# EasyEDA Pro project ProPrj_单片机_2024-09-22.epro

# Schematic Schematic1
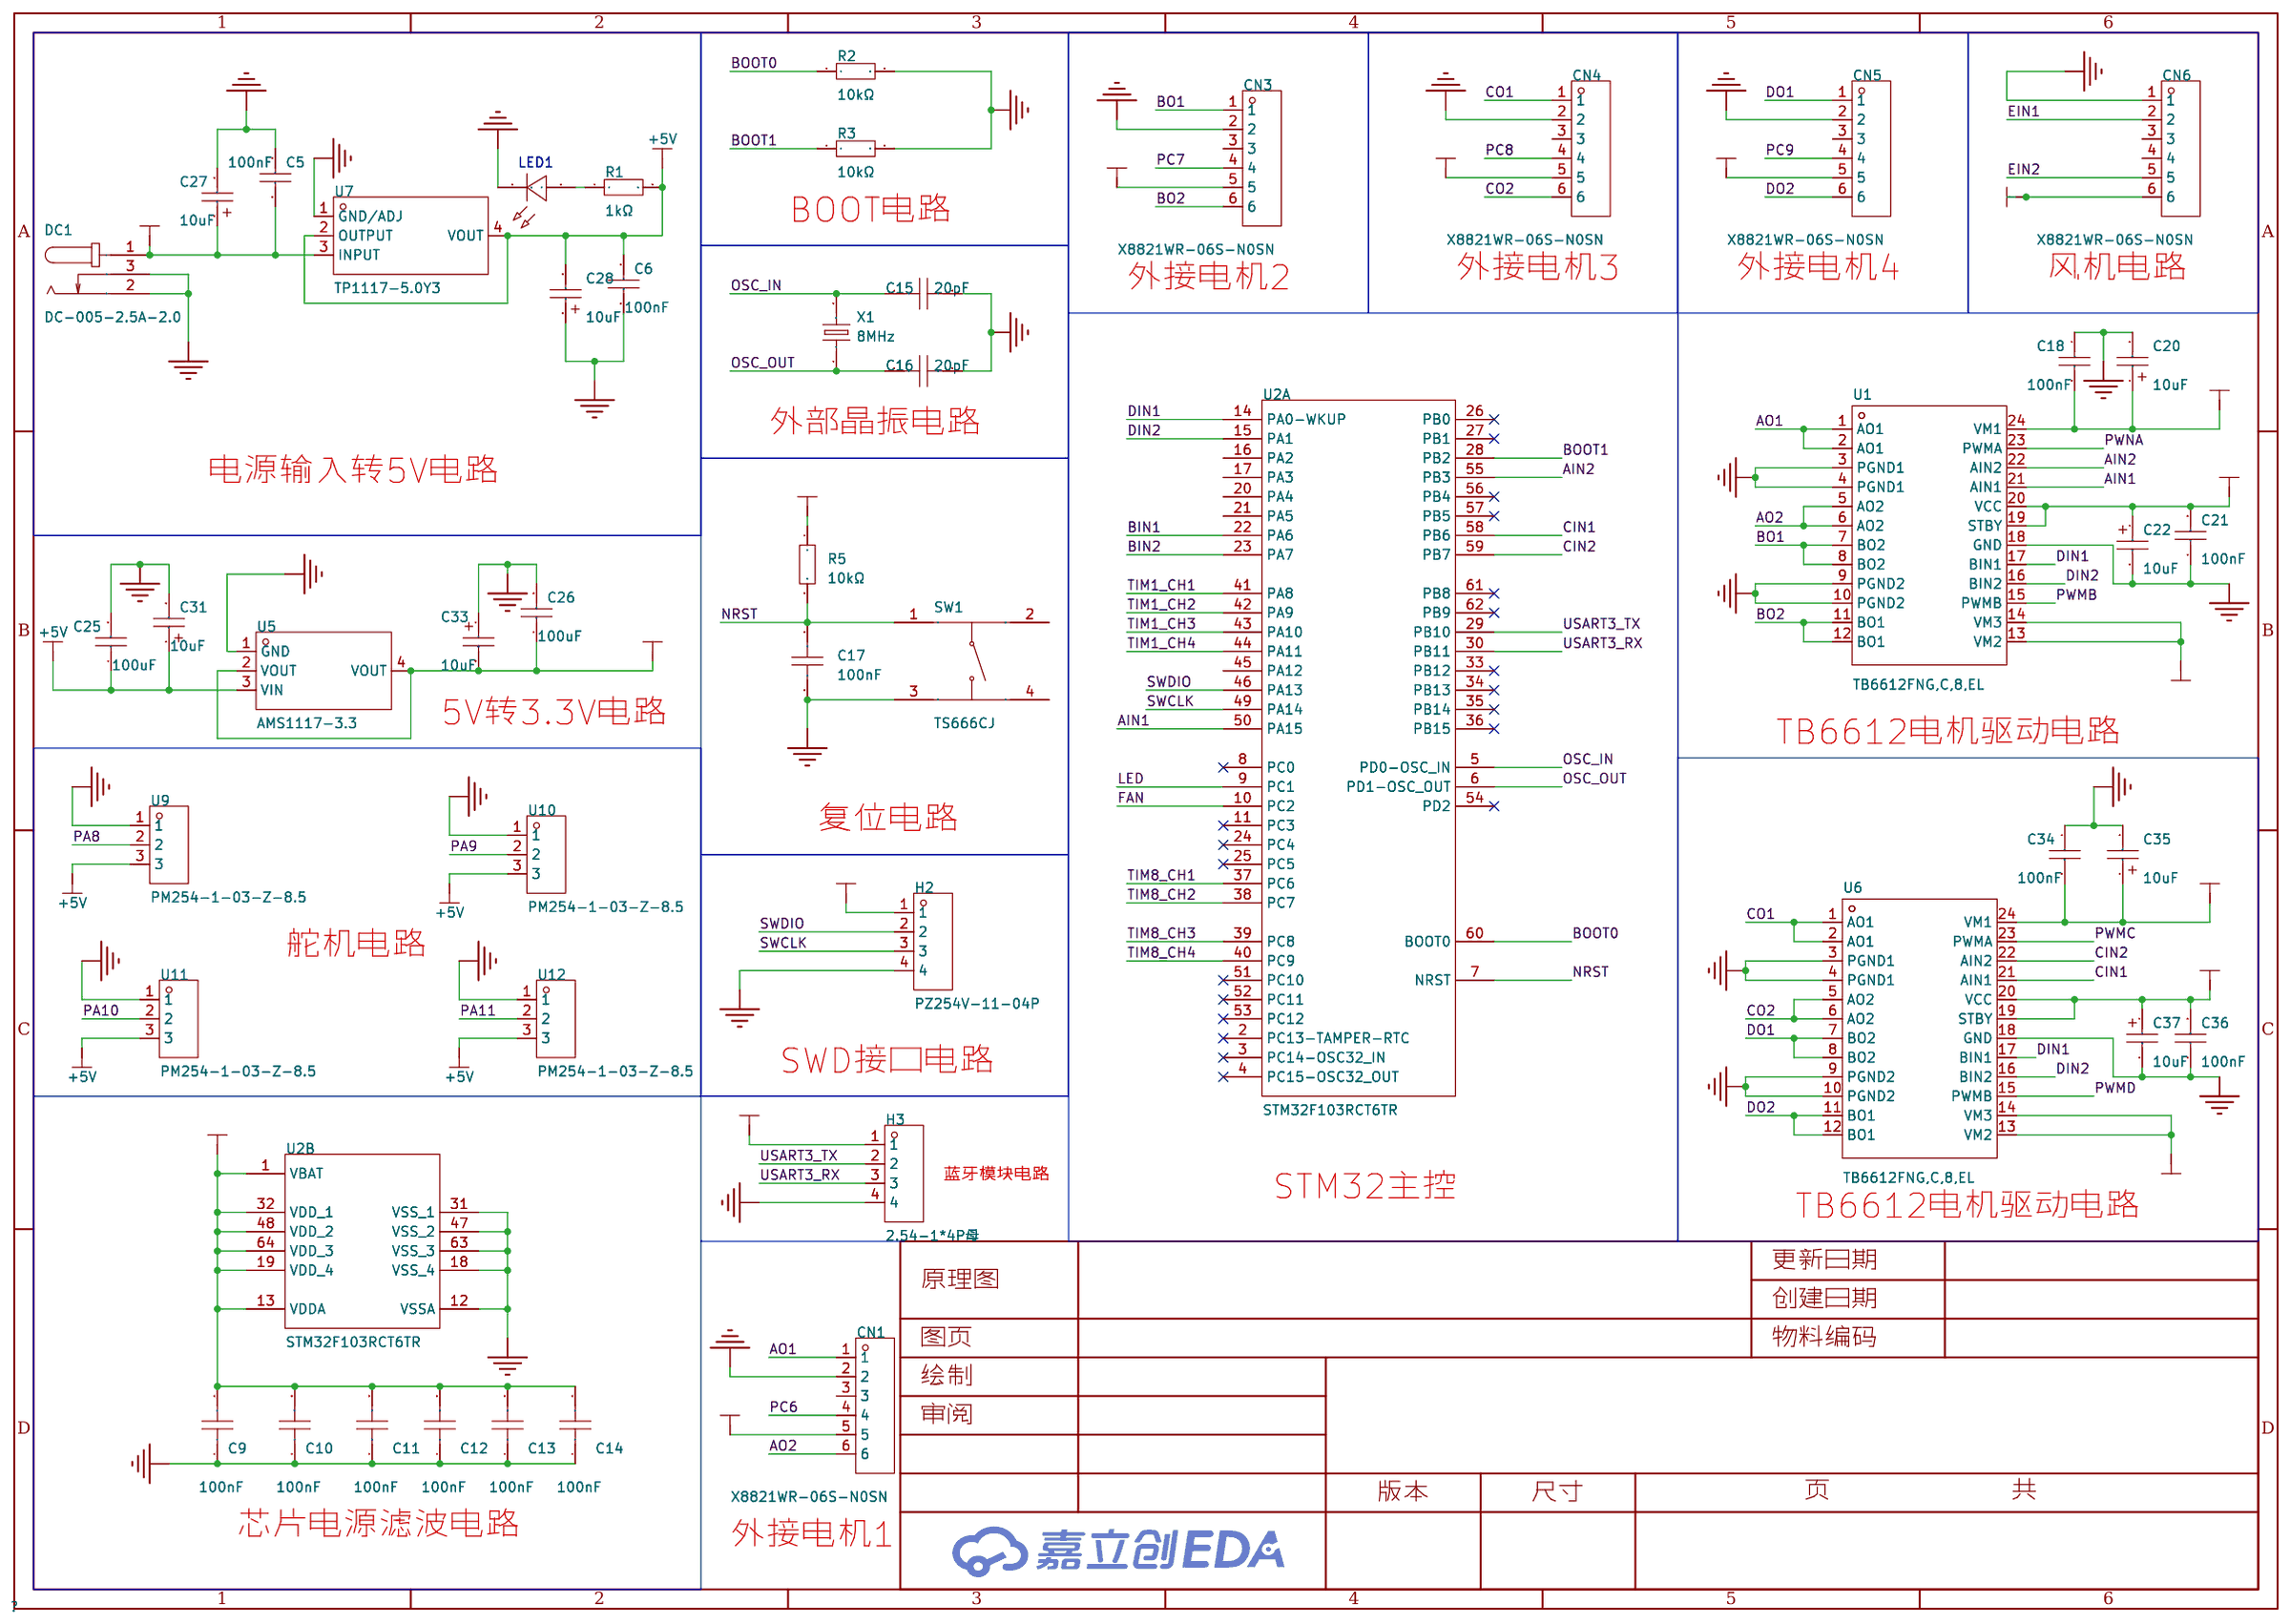
[diagram p0: schematic sheet]

## Parts
C5  100nF  [C0805]
C6  100nF  [C0805]
C9  100nF  [C0603]
C10  100nF  [C0603]
C11  100nF  [C0603]
C12  100nF  [C0603]
C13  100nF  [C0603]
C14  100nF  [C0603]
C15  20pF  [C0805]
C16  20pF  [C0805]
C17  100nF  [C0603]
C18  100nF  [C0805]
C20  10uF  [CAP-SMD_L3.2-W1.6-RD-C7171]
C21  100nF  [C0805]
C22  10uF  [CAP-SMD_L3.2-W1.6-RD-C7171]
C25  100uF  [C0805]
C26  100uF  [C0805]
C27  10uF  [CAP-SMD_L3.2-W1.6-RD-C7171]
C28  10uF  [CAP-SMD_L3.2-W1.6-RD-C7171]
C31  10uF  [CAP-SMD_L3.2-W1.6-RD-C7171]
C33  10uF  [CAP-SMD_L3.2-W1.6-RD-C7171]
C34  100nF  [C0805]
C35  10uF  [CAP-SMD_L3.2-W1.6-RD-C7171]
C36  100nF  [C0805]
C37  10uF  [CAP-SMD_L3.2-W1.6-RD-C7171]
CN1  X8821WR-06S-N0SN  [CONN-TH_6P-P2.50_X8821WR-06S-N2SN]
CN3  X8821WR-06S-N0SN  [CONN-TH_6P-P2.50_X8821WR-06S-N2SN]
CN4  X8821WR-06S-N0SN  [CONN-TH_6P-P2.50_X8821WR-06S-N2SN]
CN5  X8821WR-06S-N0SN  [CONN-TH_6P-P2.50_X8821WR-06S-N2SN]
CN6  X8821WR-06S-N0SN  [CONN-TH_6P-P2.50_X8821WR-06S-N2SN]
DC1  DC-005-2.5A-2.0  [CONN-TH_DC-005-2.5A-2.0]
H2  PZ254V-11-04P  [HDR-TH_4P-P2.54-V-M]
H3  2.54-1*4P母  [HDR-TH_4P-P2.54-V-F]
LED1  -  [LED_0805]
R1  1kΩ  [R0805]
R2  10kΩ  [R0603]
R3  10kΩ  [R0603]
R5  10kΩ  [R0603]
SW1  TS666CJ  [SW-TH_4P-L6.0-W6.0-P4.50-LS6.5]
U1  TB6612FNG,C,8,EL  [SSOP-24_L8.3-W5.6-P0.65-LS7.6-BL]
U2  STM32F103RCT6TR  [LQFP-64_L10.0-W10.0-P0.50-LS12.0-BL]  (sections 1,2)
U5  AMS1117-3.3  [SOT-223-3_L6.5-W3.4-P2.30-LS7.0-BR]
U6  TB6612FNG,C,8,EL  [SSOP-24_L8.3-W5.6-P0.65-LS7.6-BL]
U7  TP1117-5.0Y3  [SOT-223-3_L6.5-W3.4-P2.30-LS7.0-BR]
U9  PM254-1-03-Z-8.5  [HDR-TH_3P-P2.54-V-F]
U10  PM254-1-03-Z-8.5  [HDR-TH_3P-P2.54-V-F]
U11  PM254-1-03-Z-8.5  [HDR-TH_3P-P2.54-V-F]
U12  PM254-1-03-Z-8.5  [HDR-TH_3P-P2.54-V-F]
X1  8MHz  [HC-49US_L11.5-W4.5-P4.88]

## Library data of the parts
C5 C6 C18 C21 C34 C36 = CC0805KRX7R9BB104: 容值:100nF;精度:±10%;额定电压:50V;材质(温度系数):X7R;; LCSC Part Name: 100nF ±10% 50V; Supplier Part: C49678; Manufacturer: YAGEO(国巨); Supplier Footprint: 0805; JLCPCB Part Class: 基础库; Datasheet: https://atta.szlcsc.com/upload/public/pdf/source/20180224/C181747_15194369449651363981.pdf; Supplier: LCSC; Tolerance: ±10%; Voltage Rated: 50V; Temperature Coefficient: X7R
C9-C14 C17 = CC0603KRX7R9BB104: 容值:100nF;精度:±10%;额定电压:50V;材质(温度系数):X7R;; LCSC Part Name: 100nF ±10% 50V; Supplier Part: C14663; Manufacturer: YAGEO(国巨); Supplier Footprint: 0603; JLCPCB Part Class: 基础库; Datasheet: https://atta.szlcsc.com/upload/public/pdf/source/20180910/C282072_33301C7F631E79921B82A8DAC6BCC5B3.pdf; Supplier: LCSC; Tolerance: ±10%; Voltage Rated: 50V; Temperature Coefficient: X7R
C15 C16 = 0805CG200J500NT: 容值:20pF;精度:±5%;额定电压:50V;材质(温度系数):C0G;; LCSC Part Name: 20pF ±5% 50V; Supplier Part: C94472; Manufacturer: FH(风华); Supplier Footprint: 0805; JLCPCB Part Class: 扩展库; Datasheet: https://atta.szlcsc.com/upload/public/pdf/source/20200305/C486355_26A10D38EF8C2A5C37091D0039909270.pdf; Supplier: LCSC; Tolerance: ±5%; Voltage Rated: 50V; Temperature Coefficient: C0G
C20 C22 C27 C28 C31 C33 C35 C37 = TAJA106K016RNJ: 容值:10uF;精度:±10%;额定电压:16V;等效串联电阻:3Ω@100kHz;; LCSC Part Name: 10uF ±10% 16V; Supplier Part: C7171; Manufacturer: Kyocera AVX; Supplier Footprint: CASE-A-3216; JLCPCB Part Class: 基础库; Datasheet: https://atta.szlcsc.com/upload/public/pdf/source/20160107/1457707750344.pdf; Supplier: LCSC; Tolerance: ±10%; Rated Voltage: 16V; Equivalent Series Resistance(ESR): 3Ω@100kHz; Operating Temperature: -55℃~+125℃
C25 C26 = GRM21BR60J107ME15L: 容值:100uF;精度:±20%;额定电压:6.3V;材质(温度系数):X5R;; LCSC Part Name: 100uF ±20% 6.3V; Supplier Part: C141660; Manufacturer: muRata(村田); Supplier Footprint: 0805; JLCPCB Part Class: Extended Part; Datasheet: https://atta.szlcsc.com/upload/public/pdf/source/20171113/C141660_15105613320671115822.pdf; Supplier: LCSC; Tolerance: ±20%; Voltage Rated: 6.3V; Temperature Coefficient: X5R
CN1 CN3-CN6 = X8821WR-06S-N0SN: 插针结构:1x6P;间距:2.5mm;安装方式:弯插;参考系列:XH;总PIN数:6P;排数:1;每排PIN数:6;行距:-;额定电流:3A;触头材质:黄铜;触头镀层:锡;工作温度范围:-;; LCSC Part Name: 1x6P 间距:2.5mm 弯插 系列:XH; Supplier Part: C388743; Manufacturer: XKB Connection(中国星坤); Supplier Footprint: 弯插,P=2.54mm; JLCPCB Part Class: 扩展库; Datasheet: https://atta.szlcsc.com/upload/public/pdf/source/20211009/984C14C41D2B1156BCF8EEF5D296E395.pdf; Supplier: LCSC; Pins Structure: 1x6P; Pitch: 2.5mm; Mounting Style: 弯插; Reference Series: XH; Number of Pins: 6P; Number of Rows: 1; Number of PINs Per Row: 6; Current Rating (Max): 3A; Contact Material: 黄铜; Contact Plating: 锡
DC1 = DC-005-2.5A-2.0: 连接器类型:DC电源插座;安装方式:面板安装;触点内径:2mm;触点外径:6.2mm;额定电流:2.5A;额定电压:24V;触头材质:黄铜;工作温度范围:-20℃~+70℃;焊接温度(最大值):260℃;; LCSC Part Name: DC电源插座 内径:2mm 外径:6.2mm; Supplier Part: C319099; Manufacturer: XKB Connection(中国星坤); Supplier Footprint: 插件; JLCPCB Part Class: 扩展库; Datasheet: https://atta.szlcsc.com/upload/public/pdf/source/20230410/3C172F25A51FCA230ABE6D36425CBB3B.pdf; Supplier: LCSC; Connector Type: DC电源插座; Mounting Style: 面板安装; Inside Contact Diameter: 2mm; Outside Contact Diameter: 6.2mm; Current Rating (Max): 2.5A; Voltage Rating (Max): 24V; Contact Material: 黄铜; Operating Temperature Range: -20℃~+70℃; Soldering Temperature(Max): 260℃
H2 = PZ254V-11-04P: 插针结构:1x4P;间距:2.54mm;行距:-;圆针/方针:方针;安装类型:直插;排数:单排;总PIN位数:4P;额定电流:3A;额定电压:250V;配合针长度:6mm;塑高:2.5mm;端接针长度:3mm;触头材质:-;工作温度范围:-40℃~+105℃;颜色:黑色;; LCSC Part Name: 间距:2.54mm 1x4P 直插 方针; Supplier Part: C2691448; Manufacturer: XFCN(兴飞); Supplier Footprint: 插件,P=2.54mm; JLCPCB Part Class: 扩展库; Datasheet: https://atta.szlcsc.com/upload/public/pdf/source/20200309/C492403_F9F19131791D08044AD4F84F8E751A34.pdf; Supplier: LCSC; Pin Structure: 1x4P; Pitch: 2.54mm; Circluar Pins/Square Pins: 方针; Mounting Type: 直插; Number of Rows: 单排; Number of Pins: 4P; Current Rating (Max): 3A; Voltage Rating (Max): 250V; Length of Mating Pin: 6mm; Insulation Height: 2.5mm; Length of End Connection Pin: 3mm; Operating Temperature Range: -40℃~+105℃; Color: 黑色
H3 = 2.54-1*4P母: 插孔结构:1x4P;间距:2.54mm;行距:-;圆孔/方孔:方孔;安装类型:直插;排数:单排;总孔位数:4P;额定电流:3A;额定电压:-;插孔方向:顶部;塑高:-;触头材质:青铜;触头镀层:-;工作温度范围:-40℃~+105℃;焊接温度(最大值):-;; LCSC Part Name: 间距:2.54mm 1x4P 直插; Supplier Part: C2718488; Manufacturer: BOOMELE(博穆精密); Supplier Footprint: 插件,P=2.54mm; JLCPCB Part Class: 扩展库; Datasheet: https://atta.szlcsc.com/upload/public/pdf/source/20210301/C2718488_F4427B881E42CAA8DDB0B1C12B3A522C.pdf; Supplier: LCSC; Holes Structure: 1x4P; Pitch: 2.54mm; Circular Hole / Square Hole: 方孔; Mounting Type: 直插; Number of Rows: 单排; Number of Holes: 4P; Current Rating (Max): 3A; Holes Direction: 顶部; Contact Material: 青铜; Operating Temperature Range: -40℃~+105℃
LED1 = LED_0805-B: Supplier Footprint: 0805
R1 = 0805W8F1001T5E: 电阻类型:厚膜电阻;阻值:1kΩ;精度:±1%;功率:125mW;最大工作电压:150V;温度系数:±100ppm/℃;; LCSC Part Name: 1kΩ ±1% 125mW 厚膜电阻; Supplier Part: C17513; Manufacturer: UNI-ROYAL(厚声); Supplier Footprint: 0805; JLCPCB Part Class: 基础库; Datasheet: https://atta.szlcsc.com/upload/public/pdf/source/20200306/C422600_1E6D84923E4A46A82E41ADD87F860B5C.pdf; Supplier: LCSC; Type: 厚膜电阻; Tolerance: ±1%; Power(Watts): 125mW; Overload Voltage (Max): 150V; Temperature Coefficient: ±100ppm/℃; Operating Temperature Range: -55℃~+155℃
R2 R3 R5 = 0603WAF1002T5E: 电阻类型:厚膜电阻;阻值:10kΩ;精度:±1%;功率:100mW;最大工作电压:75V;温度系数:±100ppm/℃;; LCSC Part Name: 厚膜电阻 10kΩ ±1% 100mW; Supplier Part: C25804; Manufacturer: UNI-ROYAL(厚声); Supplier Footprint: 0603; JLCPCB Part Class: 基础库; Datasheet: https://atta.szlcsc.com/upload/public/pdf/source/20200306/C422600_1E6D84923E4A46A82E41ADD87F860B5C.pdf; Supplier: LCSC; Type: 厚膜电阻; Tolerance: ±1%; Power(Watts): 100mW; Overload Voltage (Max): 75V; Temperature Coefficient: ±100ppm/℃; Operating Temperature Range: -55℃~+155℃
SW1 = TS666CJ: 电路结构:单刀单掷;按钮形状:圆形按钮;作用力:250gf;安装方式:直插;开关长度:6mm;开关宽度:6mm;开关高度:6mm;带支架:不带;触点电流:50mA;额定电压(DC):12V;绝缘电阻:100MΩ;机械寿命:5万次;; LCSC Part Name: 6*6*6mm 直插 轻触开关; Supplier Part: C557621; Manufacturer: SHOU HAN(首韩); Supplier Footprint: 插件; JLCPCB Part Class: 扩展库; Datasheet: https://atta.szlcsc.com/upload/public/pdf/source/20200519/C557621_524FC94A9E7193E97F84899CC7F1F8B2.pdf; Supplier: LCSC; Circuit: 单刀单掷; Actuator Style: 圆形按钮; Operating Force: 250gf; Mounting Style: 直插; Switch Length: 6mm; Switch Width: 6mm; Switch Height: 6mm; Strike Gundam: 不带; Contact Current: 50mA; Voltage Rating (DC): 12V; Insulation Resistance: 100MΩ; Actuator/Cap Color: 黑色; Pin Style: PC引脚; Mechanical Life: 5万次; Operating Temperature: -20℃~+85℃
U1 U6 = TB6612FNG,C,8,EL: LCSC Part Name: 1A 有刷直流电机驱动芯片 5.5V; Supplier Part: C141517; Manufacturer: TOSHIBA(东芝); Supplier Footprint: SSOP-24; JLCPCB Part Class: 扩展库; Datasheet: https://atta.szlcsc.com/upload/public/pdf/source/20171128/C141517_15118625624231147036.pdf; Supplier: LCSC
U2 = STM32F103RCT6TR: CPU内核:ARM-M3;程序存储容量:256KB;RAM总容量:48KB;GPIO端口数量:51;工作电压范围:2V~3.6V;CPU最大主频:72MHz;程序存储器类型:FLASH;; LCSC Part Name: 主流增强型ARM Cortex-M3 MCU，具有256 KB Flash、72 MHz CPU、电机控制、USB和CAN; Supplier Part: C39704; Manufacturer: ST(意法半导体); Supplier Footprint: LQFP-64(10x10); JLCPCB Part Class: 扩展库; Datasheet: https://atta.szlcsc.com/upload/public/pdf/source/20151012/1457707442737.pdf; Supplier: LCSC; CPU Core: ARM-M3; Program Storage Size: 256KB; RAM Size: 48KB; GPIO Ports Number: 51; Operating Voltage Range: 2V~3.6V; CPU Maximum Speed: 72MHz; Program Memory Type: FLASH; Operating Temperature Range: -40℃~+85℃; ADC (Bit): 12bit; DAC (Bit): 12bit; Universal Serial Bus: 有; Peripheral/Function: 看门狗；DMA；看门狗；温度传感器; Watchdog: 有; Infrared Data Association: 有; Low-Voltage Detect: 有; Direct Memory Access: 有; Internal Oscillator: 有
U5 = AMS1117-3.3_C6186: 输出类型:固定;最大输入电压:-;输出电压:3.3V;最大输出电流:1A;电源纹波抑制比(PSRR):72dB@(120Hz);输出极性:正极;; LCSC Part Name: 输出3.3V 1A; Supplier Part: C6186; Manufacturer: AMS; Supplier Footprint: SOT-223; JLCPCB Part Class: 基础库; Datasheet: https://atta.szlcsc.com/upload/public/pdf/source/20180727/C6186_7A095716F0823C02F1997A905E26C086.pdf; Supplier: LCSC; Output Type: 固定; Output Voltage: 3.3V; MAX Output Current: 1A; Power Supply Rejection Ratio (PSRR): 72dB@(120Hz); Dropout Voltage: 1.3V@(800mA); Output Polarity: 正极; Number of Outputs: 1
U7 = TP1117-5.0Y3: Supplier Part: C18212700; Manufacturer: TECH PUBLIC(台舟); Supplier Footprint: SOT-223; JLCPCB Part Class: 扩展库; Datasheet: https://atta.szlcsc.com/upload/public/pdf/source/20231020/15FA3214E61D91131000BDD217625D22.pdf; Supplier: LCSC
U9-U12 = PM254-1-03-Z-8.5: 插孔结构:1x3P;间距:2.54mm;行距:-;圆孔/方孔:方孔;安装类型:直插;排数:单排;总孔位数:3P;额定电流:3A;额定电压:-;插孔方向:顶部;塑高:8.5mm;触头材质:铜合金;工作温度范围:-40℃~+105℃;焊接温度(最大值):260℃@5S;; LCSC Part Name: 1x3P 间距:2.54mm 直插; Supplier Part: C2897366; Manufacturer: HCTL(华灿天禄); Supplier Footprint: 插件,P=2.54mm; JLCPCB Part Class: 扩展库; Datasheet: https://atta.szlcsc.com/upload/public/pdf/source/20230609/534BE42964C679BDE98E061007C4ABD6.pdf; Supplier: LCSC; Holes Structure: 1x3P; Pitch: 2.54mm; Circular Hole / Square Hole: 方孔; Mounting Type: 直插; Number of Rows: 单排; Number of Holes: 3P; Current Rating (Max): 3A; Holes Direction: 顶部; Insulation Height: 8.5mm; Contact Material: 铜合金; Operating Temperature Range: -40℃~+105℃; Soldering Temperature(Max): 260℃@5S
X1 = 49S-8.000-20-20-20/A: 晶振类型:直插晶振;频率:8MHz;常温频差:±20ppm;外接负载电容:20pF;频率稳定度(全温):±20ppm;; LCSC Part Name: 8MHz ±20ppm 20pF; Supplier Part: C240916; Manufacturer: LIMING(利明); Supplier Footprint: HC-49S; JLCPCB Part Class: 扩展库; Datasheet: https://atta.szlcsc.com/upload/public/pdf/source/20180930/C240954_D21D826943E58A9880472B1227802F84.pdf; Supplier: LCSC; Crystal Type: 直插晶振; Normal temperature Frequency Tolerance: ±20ppm; External load capacitor: 20pF; Frequency Stability(Full temperature range): ±20ppm; Operating Temperature: -20℃~+70℃

## Nets
8V: C5.2 C27.1 DC1.1 U7.3(INPUT)
+3.3V: C9.2 C10.2 C11.2 C12.2 C13.2 C14.2 C21.2 C22.1 C26.1 C33.2 C36.2 C37.1 CN1.5 CN3.5 CN4.5 CN5.5 H2.1 H3.1 R5.1 U1.19(STBY) U1.20(VCC) U2.1(VBAT) U2.13(VDDA) U2.19(VDD_4) U2.32(VDD_1) U2.48(VDD_2) U2.64(VDD_3) U5.2(VOUT) U5.4(VOUT) U6.19(STBY) U6.20(VCC)
+5V: C6.1 C25.1 C28.2 C31.1 R1.2 U5.3(VIN) U7.2(OUTPUT) U7.4(VOUT) U9.3 U10.3 U11.3 U12.3
+8V: C18.2 C20.1 C34.2 C35.1 U1.13(VM2) U1.14(VM3) U1.24(VM1) U6.13(VM2) U6.14(VM3) U6.24(VM1)
+12V: CN6.6
GND: C5.1 C6.2 C9.1 C10.1 C11.1 C12.1 C13.1 C14.1 C15.2 C16.2 C17.1 C18.1 C20.2 C21.1 C22.2 C25.2 C26.2 C27.2 C28.1 C31.2 C33.1 C34.1 C35.2 C36.1 C37.2 CN1.2 CN3.2 CN4.2 CN5.2 CN6.1 DC1.2 DC1.3 H2.4 H3.4 LED1.1(C) R2.2 R3.2 SW1.3(C) U1.3(PGND1) U1.4(PGND1) U1.9(PGND2) U1.10(PGND2) U1.18(GND) U2.12(VSSA) U2.18(VSS_4) U2.31(VSS_1) U2.47(VSS_2) U2.63(VSS_3) U5.1(GND) U6.3(PGND1) U6.4(PGND1) U6.9(PGND2) U6.10(PGND2) U6.18(GND) U7.1(GND/ADJ) U9.1 U10.1 U11.1 U12.1
AIN1: U1.21(AIN1) U2.50(PA15)
AIN2: U1.22(AIN2) U2.55(PB3)
AO1: CN1.1 U1.1(AO1) U1.2(AO1)
AO2: CN1.6 U1.5(AO2) U1.6(AO2)
BIN1: U2.22(PA6)
BIN2: U2.23(PA7)
BO1: CN3.1 U1.7(BO2) U1.8(BO2)
BO2: CN3.6 U1.11(BO1) U1.12(BO1)
BOOT0: R2.1 U2.60(BOOT0)
BOOT1: R3.1 U2.28(PB2)
CIN1: U2.58(PB6) U6.21(AIN1)
CIN2: U2.59(PB7) U6.22(AIN2)
CO1: CN4.1 U6.1(AO1) U6.2(AO1)
CO2: CN4.6 U6.5(AO2) U6.6(AO2)
DIN1: U1.17(BIN1) U2.14(PA0-WKUP) U6.17(BIN1)
DIN2: U1.16(BIN2) U2.15(PA1) U6.16(BIN2)
DO1: CN5.1 U6.7(BO2) U6.8(BO2)
DO2: CN5.6 U6.11(BO1) U6.12(BO1)
EIN1: CN6.2
EIN2: CN6.5
FAN: U2.10(PC2)
LED: U2.9(PC1)
NRST: C17.2 R5.2 SW1.1(A) U2.7(NRST)
OSC_IN: C15.1 U2.5(PD0-OSC_IN) X1.2
OSC_OUT: C16.1 U2.6(PD1-OSC_OUT) X1.1
PA8: U9.2
PA9: U10.2
PA10: U11.2
PA11: U12.2
PC6: CN1.4
PC7: CN3.4
PC8: CN4.4
PC9: CN5.4
PWMB: U1.15(PWMB)
PWMC: U6.23(PWMA)
PWMD: U6.15(PWMB)
PWNA: U1.23(PWMA)
SWCLK: H2.3 U2.49(PA14)
SWDIO: H2.2 U2.46(PA13)
TIM1_CH1: U2.41(PA8)
TIM1_CH2: U2.42(PA9)
TIM1_CH3: U2.43(PA10)
TIM1_CH4: U2.44(PA11)
TIM8_CH1: U2.37(PC6)
TIM8_CH2: U2.38(PC7)
TIM8_CH3: U2.39(PC8)
TIM8_CH4: U2.40(PC9)
USART3_RX: H3.3 U2.30(PB11)
USART3_TX: H3.2 U2.29(PB10)
Net-(LED1-2): LED1.2(A) R1.1

Not connected (* = marked no-connect by the designer): CN1 3; CN3 3; CN4 3; CN5 3; CN6 3 4; SW1 2(B) 4(D); U2 2(PC13-TAMPER-RTC)* 3(PC14-OSC32_IN)* 4(PC15-OSC32_OUT)* 8(PC0)* 11(PC3)* 16(PA2) 17(PA3) 20(PA4) 21(PA5) 24(PC4)* 25(PC5)* 26(PB0)* 27(PB1)* 33(PB12)* 34(PB13)* 35(PB14)* 36(PB15)* 45(PA12) 51(PC10)* 52(PC11)* 53(PC12)* 54(PD2)* 56(PB4)* 57(PB5)* 61(PB8)* 62(PB9)*

## Notes on the sheet
- BOOT电路
- 外接电机2
- 外接电机3
- 外接电机4
- 风机电路
- 外部晶振电路
- 电源输入转5V电路
- 5V转3.3V电路
- TB6612电机驱动电路
- 复位电路
- 舵机电路
- SWD接口电路
- 蓝牙模块电路
- STM32主控
- TB6612电机驱动电路
- 芯片电源滤波电路
- 外接电机1

# Board PCB1
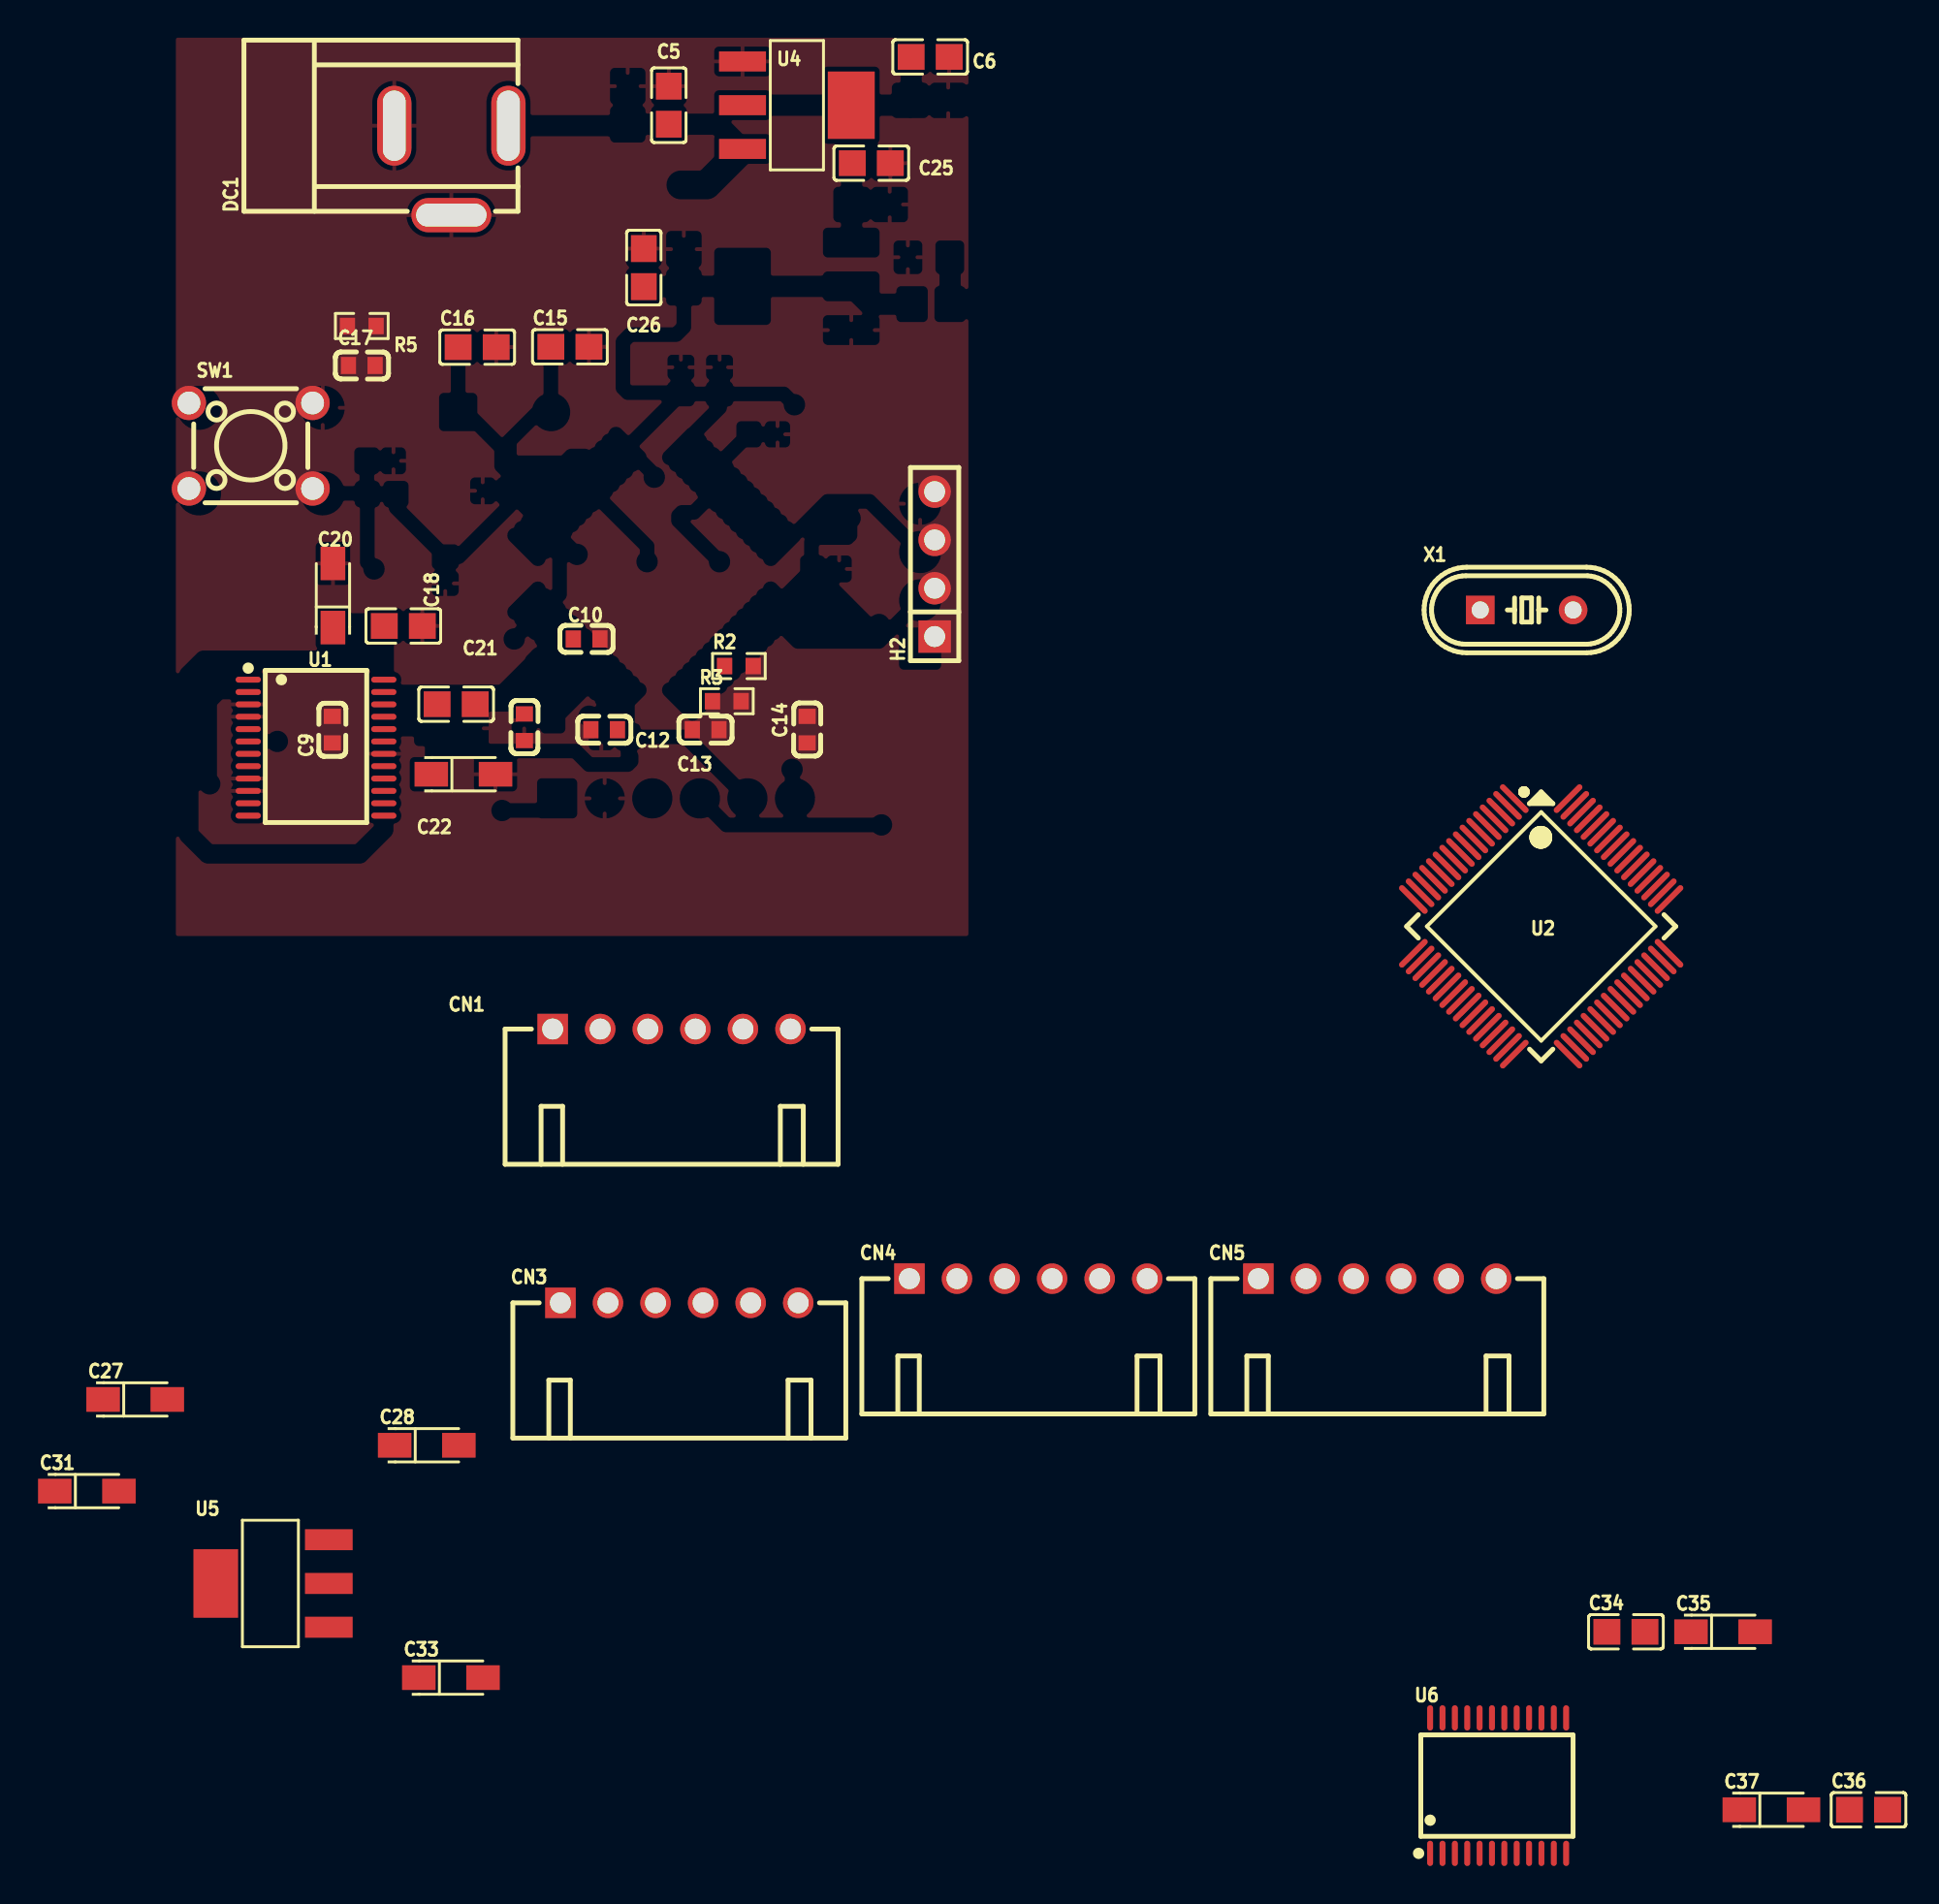
[diagram p1: board, top side]
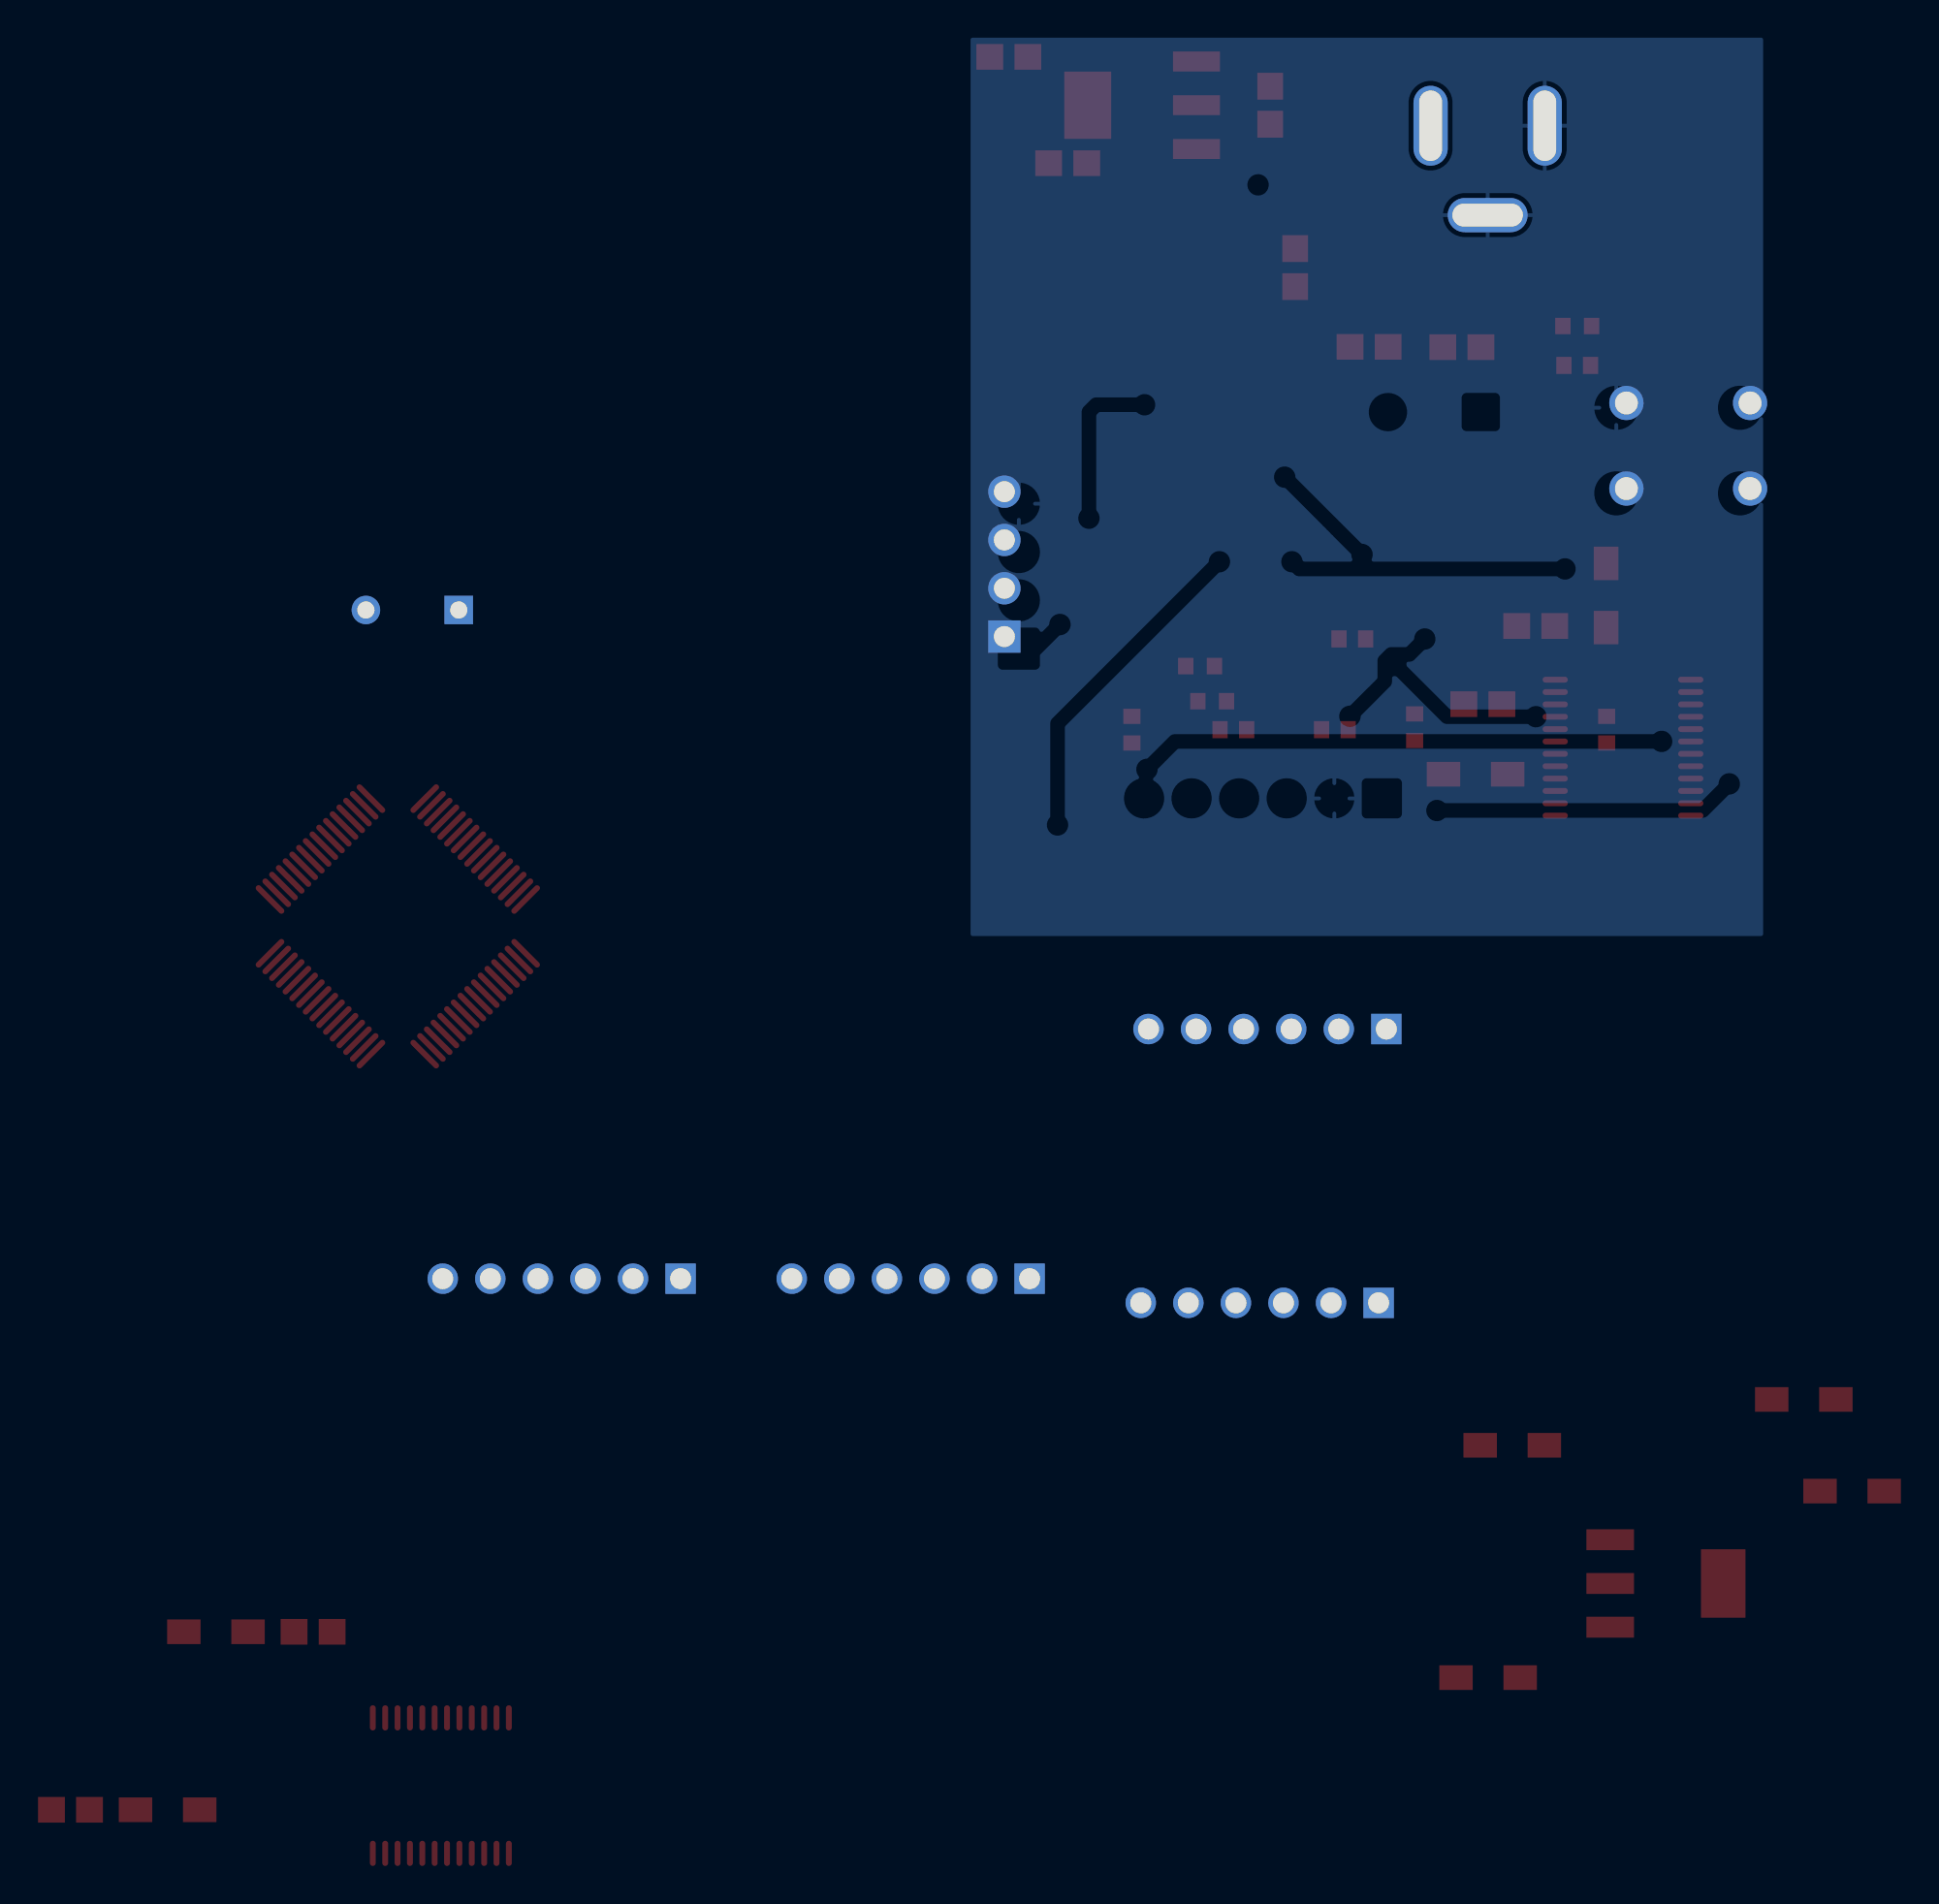
[diagram p2: board, bottom side, seen from below]

No outline. copper layers: Top Layer, Bottom Layer. Coordinates in mm from the lowest, leftmost part position.
Stack: Top Layer 0.035mm / Dielectric1 1.51mm FR4 er 4.5 / Bottom Layer 0.035mm

## Design rules (mm)
net OSC_IN: DP1
net OSC_OUT: DP1
net SWCLK: DP2
net SWDIO: DP2
template: JLCPCB Capability(Two Layers Board)
spacing copperThickness1oz (default): track to track 0.102, other pairs 0.152 to 0.3
spacing copperThickness2oz: track to track 0.203, other pairs 0.152 to 0.3
track width copperThickness1oz (default): min 0.127, default 0.254, max 2.54
track width copperThickness2oz: min 0.203, default 0.254, max 2.54
differential pair differentialPair (default): width min 0.127, default 0.254, max 2.54; gap min 0.152, default 0.152
via viaSize (default): diameter min 0.5, default 0.61, max 10; hole min 0.3, default 0.305, max 6.3

## Placement (name value [footprint] x y rotation side)
C5  100nF  [C0805]  30.58 89.63 270 top
C6  100nF  [C0805]  44.32 92.17 0 top
C9  100nF  [C0603]  12.9 56.8 90 top
C10  100nF  [C0603]  26.27 61.56 0 top
C11  100nF  [C0603]  22.99 56.92 270 top
C12  100nF  [C0603]  27.19 56.8 180 top
C13  100nF  [C0603]  32.52 56.8 0 top
C14  100nF  [C0603]  37.85 56.8 270 top
C15  20pF  [C0805]  25.39 76.93 0 top
C16  20pF  [C0805]  20.51 76.91 0 top
C17  100nF  [C0603]  14.45 75.95 180 top
C18  100nF  [C0805]  16.63 62.25 180 top
C20  10uF  [CAP-SMD_L3.2-W1.6-RD-C7171]  12.93 63.85 90 top
C21  100nF  [C0805]  19.41 58.14 180 top
C22  10uF  [CAP-SMD_L3.2-W1.6-RD-C7171]  19.79 54.45 0 top
C25  100uF  [C0805]  41.23 86.58 0 top
C26  100uF  [C0805]  29.27 81.09 90 top
C27  10uF  [CAP-SMD_L3.2-W1.6-RD-C7171]  2.54 21.58 0 top
C28  10uF  [CAP-SMD_L3.2-W1.6-RD-C7171]  17.86 19.17 0 top
C31  10uF  [CAP-SMD_L3.2-W1.6-RD-C7171]  0 16.76 0 top
C33  10uF  [CAP-SMD_L3.2-W1.6-RD-C7171]  19.13 6.95 0 top
C34  100nF  [C0805]  80.89 9.36 0 top
C35  10uF  [CAP-SMD_L3.2-W1.6-RD-C7171]  85.99 9.36 0 top
C36  100nF  [C0805]  93.63 0 0 top
C37  10uF  [CAP-SMD_L3.2-W1.6-RD-C7171]  88.53 0 0 top
CN1  X8821WR-06S-N0SN  [CONN-TH_6P-P2.50_X8821WR-06S-N2SN]  30.73 41.05 0 top
CN3  X8821WR-06S-N0SN  [CONN-TH_6P-P2.50_X8821WR-06S-N2SN]  31.14 26.66 0 top
CN4  X8821WR-06S-N0SN  [CONN-TH_6P-P2.50_X8821WR-06S-N2SN]  49.48 27.93 0 top
CN5  X8821WR-06S-N0SN  [CONN-TH_6P-P2.50_X8821WR-06S-N2SN]  67.82 27.93 0 top
DC1  DC-005-2.5A-2.0  [CONN-TH_DC-005-2.5A-2.0]  19.15 86.2 0 top
H2  PZ254V-11-04P  [HDR-TH_4P-P2.54-V-M]  44.55 65.5 90 top
R2  10kΩ  [R0603]  34.27 60.14 0 top
R3  10kΩ  [R0603]  33.63 58.29 180 top
R5  10kΩ  [R0603]  14.45 78.02 180 top
SW1  TS666CJ  [SW-TH_4P-L6.0-W6.0-P4.50-LS6.5]  8.61 71.72 180 top
U1  TB6612FNG,C,8,EL  [SSOP-24_L8.3-W5.6-P0.65-LS7.6-BL]  12.04 55.85 270 top
U2  STM32F103RCT6TR  [LQFP-64_L10.0-W10.0-P0.50-LS12.0-BL]  76.43 46.45 225 top
U4  AMS1117-5.0  [SOT-223_L6.5-W3.5-P2.30-LS7.0-BR]  37.32 89.63 180 top
U5  AMS1117-3.3  [SOT-223-3_L6.5-W3.4-P2.30-LS7.0-BR]  9.75 11.9 0 top
U6  TB6612FNG,C,8,EL  [SSOP-24_L8.3-W5.6-P0.65-LS7.6-BL]  74.17 1.27 0 top
X1  8MHz  [HC-49US_L11.5-W4.5-P4.88]  75.67 63.09 0 top

## Footprints (pads in the part's own frame, mm; a bottom-side part is the same pattern mirrored in y, then rotated)
C0603
  rect 0.8x0.9 smd: 1(-0.7,0) 2(0.7,0)
C0805
  rect 1.41x1.35 smd: 1(-1,0) 2(1,0)
CAP-SMD_L3.2-W1.6-RD-C7171
  rect 1.758x1.296 smd: 1(-1.687,0) 2(1.687,0)
CONN-TH_6P-P2.50_X8821WR-06S-N2SN
  rect 1.6x1.6 hole 1.1: 1(-6.25,0)
  round 1.6 hole 1.1: 2(-3.75,0) 3(-1.25,0) 4(1.25,0) 5(3.75,0) 6(6.25,0)
CONN-TH_DC-005-2.5A-2.0
  oval 1.8x4.2 hole 1.2x3.7: 1(2.999,2.35) 2(-2.999,2.35)
  oval 4.2x1.8 hole 3.7x1.2: 3(0,-2.35)
HC-49US_L11.5-W4.5-P4.88
  rect 1.5x1.5 hole 0.9: 1(-2.44,0)
  round 1.5 hole 0.9: 2(2.44,0)
HDR-TH_4P-P2.54-V-M
  rect 1.7x1.7 hole 1.1: 1(-3.81,0)
  round 1.7 hole 1.1: 2(-1.27,0) 3(1.27,0) 4(3.81,0)
LQFP-64_L10.0-W10.0-P0.50-LS12.0-BL
  oval 0.3x2 smd: 1(-3.75,-5.75) 2(-3.25,-5.75) 3(-2.75,-5.75) 4(-2.25,-5.75) 5(-1.75,-5.75) 6(-1.25,-5.75) 7(-0.75,-5.75) 8(-0.25,-5.75) 9(0.25,-5.75) 10(0.75,-5.75) 11(1.25,-5.75) 12(1.75,-5.75) 13(2.25,-5.75) 14(2.75,-5.75) 15(3.25,-5.75) 16(3.75,-5.75) 33(3.75,5.75) 34(3.25,5.75) 35(2.75,5.75) 36(2.25,5.75) 37(1.75,5.75) 38(1.25,5.75) 39(0.75,5.75) 40(0.25,5.75) 41(-0.25,5.75) 42(-0.75,5.75) 43(-1.25,5.75) 44(-1.75,5.75) 45(-2.25,5.75) 46(-2.75,5.75) 47(-3.25,5.75) 48(-3.75,5.75)
  oval 2x0.3 smd: 17(5.75,-3.75) 18(5.75,-3.25) 19(5.75,-2.75) 20(5.75,-2.25) 21(5.75,-1.75) 22(5.75,-1.25) 23(5.75,-0.75) 24(5.75,-0.25) 25(5.75,0.25) 26(5.75,0.75) 27(5.75,1.25) 28(5.75,1.75) 29(5.75,2.25) 30(5.75,2.75) 31(5.75,3.25) 32(5.75,3.75) 49(-5.75,3.75) 50(-5.75,3.25) 51(-5.75,2.75) 52(-5.75,2.25) 53(-5.75,1.75) 54(-5.75,1.25) 55(-5.75,0.75) 56(-5.75,0.25) 57(-5.75,-0.25) 58(-5.75,-0.75) 59(-5.75,-1.25) 60(-5.75,-1.75) 61(-5.75,-2.25) 62(-5.75,-2.75) 63(-5.75,-3.25) 64(-5.75,-3.75)
R0603
  rect 0.806x0.864 smd: 1(-0.753,0) 2(0.753,0)
SOT-223-3_L6.5-W3.4-P2.30-LS7.0-BR
  rect 2.5x1.1 smd: 1(2.97,-2.3) 2(2.97,0) 3(2.97,2.3)
  rect 2.34x3.6 smd: 4(-2.97,0)
SOT-223_L6.5-W3.5-P2.30-LS7.0-BR
  rect 2.465x1.05 smd: 1(2.857,-2.3) 2(2.857,0) 3(2.857,2.3)
  rect 2.465x3.54 smd: 4(-2.857,0)
SSOP-24_L8.3-W5.6-P0.65-LS7.6-BL
  oval 0.308x1.324 smd: 1(-3.575,-3.562) 2(-2.925,-3.562) 3(-2.275,-3.562) 4(-1.625,-3.562) 5(-0.975,-3.562) 6(-0.325,-3.562) 7(0.325,-3.562) 8(0.975,-3.562) 9(1.625,-3.562) 10(2.275,-3.562) 11(2.925,-3.562) 12(3.575,-3.562) 13(3.575,3.562) 14(2.925,3.562) 15(2.275,3.562) 16(1.625,3.562) 17(0.975,3.562) 18(0.325,3.562) 19(-0.325,3.562) 20(-0.975,3.562) 21(-1.625,3.562) 22(-2.275,3.562) 23(-2.925,3.562) 24(-3.575,3.562)
SW-TH_4P-L6.0-W6.0-P4.50-LS6.5
  round 1.8 hole 1.2: 1(-3.25,2.25) 2(3.25,2.25) 3(-3.25,-2.25) 4(3.25,-2.25)

## Nets
8V: C5.2 C27.1 DC1.1 U4.3
+3.3V: C9.2 C10.2 C11.2 C12.2 C13.2 C14.2 C21.2 C22.1 C26.1 C33.2 C36.2 C37.1 CN1.5 CN3.5 CN4.5 CN5.5 H2.1 R5.1 U1.19 U1.20 U2.1 U2.13 U2.19 U2.32 U2.48 U2.64 U5.2 U5.4 U6.19 U6.20
+5V: C6.1 C25.1 C28.2 C31.1 U4.2 U4.4 U5.3
+8V: C18.2 C20.1 C34.2 C35.1 U1.13 U1.14 U1.24 U6.13 U6.14 U6.24
GND: C5.1 C6.2 C9.1 C10.1 C11.1 C12.1 C13.1 C14.1 C15.2 C16.2 C17.1 C18.1 C20.2 C21.1 C22.2 C25.2 C26.2 C27.2 C28.1 C31.2 C33.1 C34.1 C35.2 C36.1 C37.2 CN1.2 CN3.2 CN4.2 CN5.2 DC1.2 DC1.3 H2.4 R2.2 R3.2 SW1.3 U1.3 U1.4 U1.9 U1.10 U1.18 U4.1 U5.1 U6.3 U6.4 U6.9 U6.10 U6.18
AIN1: U1.21 U2.23
AIN2: U1.22 U2.24
AO1: CN1.1 U1.1 U1.2
AO2: CN1.6 U1.5 U1.6
ASPEED: CN1.4 CN3.4 CN4.4 CN5.4 U2.58
BO1: CN3.1 U1.7 U1.8
BO2: CN3.6 U1.11 U1.12
BOOT0: R2.1 U2.60
BOOT1: R3.1 U2.28
CIN1: U6.21
CIN2: U6.22
CO1: CN4.1 U6.1 U6.2
CO2: CN4.6 U6.5 U6.6
DIN1: U6.17
DIN2: U6.16
DO1: CN5.1 U6.7 U6.8
DO2: CN5.6 U6.11 U6.12
NRST: C17.2 R5.2 SW1.1 U2.7
OSC_IN: C15.1 U2.5 X1.2
OSC_OUT: C16.1 U2.6 X1.1
PWMB: U1.15
PWMC: U6.23
PWMD: U6.15
PWNA: U1.23 U2.22
SWCLK: H2.3 U2.49
SWDIO: H2.2 U2.46

Pads without a net: CN1 3; CN3 3; CN4 3; CN5 3; SW1 2 4; U1 16 17; U2 2 3 4 8 9 10 11 12 14 15 16 17 18 20 21 25 26 27 29 30 31 33 34 35 36 37 38 39 40 41 42 43 44 45 47 50 51 52 53 54 55 56 57 59 61 62 63

## Copper pours and planes (outline as drawn; the poured copper is in the pictures)
GND on Top Layer: -2.56,100.05 59.03,100.05 59.03,39.97 -2.56,39.97
GND on Bottom Layer: 1.5,99.41 55.98,99.41 55.98,35.53 1.5,35.53
